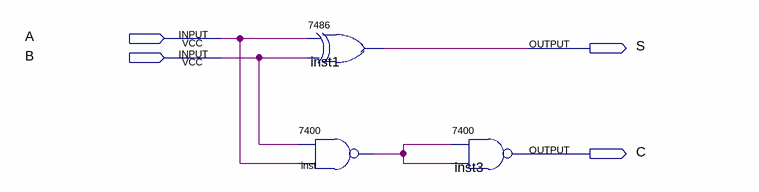
[diagram p0: schematic sheet]
// Quartus schematic Block1.bdf as structural Verilog: 3 symbols, 4 pins
module Block1 (
  input  A,
  input  B,
  output S,
  output C
);

  wire inst_1;

  \7400  inst (.\3 (A), .\2 (B), .\1 (inst_1));
  \7486  inst1 (.\2 (A), .\3 (B), .\1 (S));
  \7400  inst3 (.\3 (inst_1), .\2 (inst_1), .\1 (C));
endmodule
